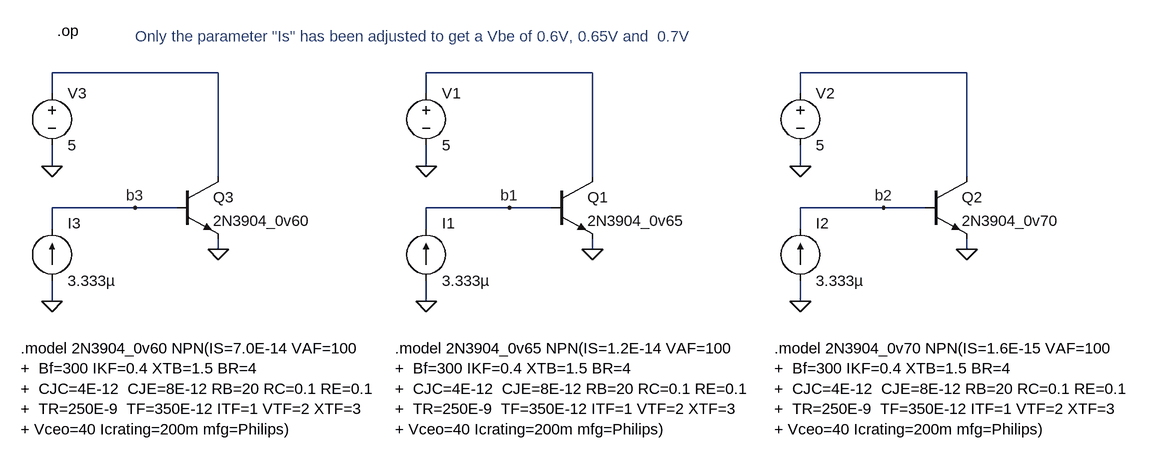
[diagram p0: schematic vbe_adjust.asc]
vbe_adjust.asc, the LTspice schematic file:
Version 4
SHEET 1 1172 680
WIRE -336 -64 -592 -64
WIRE 240 -64 -16 -64
WIRE 816 -64 560 -64
WIRE -592 -32 -592 -64
WIRE -16 -32 -16 -64
WIRE 560 -32 560 -64
WIRE -592 80 -592 48
WIRE -16 80 -16 48
WIRE 560 80 560 48
WIRE -336 96 -336 -64
WIRE 240 96 240 -64
WIRE 816 96 816 -64
WIRE -464 144 -592 144
WIRE -400 144 -464 144
WIRE 112 144 -16 144
WIRE 176 144 112 144
WIRE 688 144 560 144
WIRE 752 144 688 144
WIRE -592 176 -592 144
WIRE -16 176 -16 144
WIRE 560 176 560 144
WIRE -336 208 -336 192
WIRE 240 208 240 192
WIRE 816 208 816 192
WIRE -592 288 -592 256
WIRE -16 288 -16 256
WIRE 560 288 560 256
FLAG 240 208 0
FLAG -16 288 0
FLAG -16 80 0
FLAG 112 144 b1
FLAG 816 208 0
FLAG 560 288 0
FLAG 560 80 0
FLAG 688 144 b2
FLAG -336 208 0
FLAG -592 288 0
FLAG -592 80 0
FLAG -464 144 b3
SYMBOL npn 176 96 R0
SYMATTR InstName Q1
SYMATTR Value 2N3904_0v65
SYMBOL current -16 256 M180
WINDOW 0 24 88 Left 0
WINDOW 3 24 0 Left 0
SYMATTR InstName I1
SYMATTR Value 3.333µ
SYMBOL voltage -16 -48 R0
SYMATTR InstName V1
SYMATTR Value 5
SYMBOL npn 752 96 R0
SYMATTR InstName Q2
SYMATTR Value 2N3904_0v70
SYMBOL current 560 256 M180
WINDOW 0 24 88 Left 0
WINDOW 3 24 0 Left 0
SYMATTR InstName I2
SYMATTR Value 3.333µ
SYMBOL voltage 560 -48 R0
SYMATTR InstName V2
SYMATTR Value 5
SYMBOL npn -400 96 R0
SYMATTR InstName Q3
SYMATTR Value 2N3904_0v60
SYMBOL current -592 256 M180
WINDOW 0 24 88 Left 0
WINDOW 3 24 0 Left 0
SYMATTR InstName I3
SYMATTR Value 3.333µ
SYMBOL voltage -592 -48 R0
SYMATTR InstName V3
SYMATTR Value 5
TEXT 520 360 Left 0 !.model 2N3904_0v70 NPN(IS=1.6E-15 VAF=100\n+  Bf=300 IKF=0.4 XTB=1.5 BR=4\n+  CJC=4E-12  CJE=8E-12 RB=20 RC=0.1 RE=0.1\n+  TR=250E-9  TF=350E-12 ITF=1 VTF=2 XTF=3 \n+ Vceo=40 Icrating=200m mfg=Philips)
TEXT -584 -128 Left 0 !.op
TEXT -64 360 Left 0 !.model 2N3904_0v65 NPN(IS=1.2E-14 VAF=100\n+  Bf=300 IKF=0.4 XTB=1.5 BR=4\n+  CJC=4E-12  CJE=8E-12 RB=20 RC=0.1 RE=0.1\n+  TR=250E-9  TF=350E-12 ITF=1 VTF=2 XTF=3 \n+ Vceo=40 Icrating=200m mfg=Philips)
TEXT -640 360 Left 0 !.model 2N3904_0v60 NPN(IS=7.0E-14 VAF=100\n+  Bf=300 IKF=0.4 XTB=1.5 BR=4\n+  CJC=4E-12  CJE=8E-12 RB=20 RC=0.1 RE=0.1\n+  TR=250E-9  TF=350E-12 ITF=1 VTF=2 XTF=3 \n+ Vceo=40 Icrating=200m mfg=Philips)
TEXT -464 -120 Left 0 ;Only the parameter "Is" has been adjusted to get a Vbe of 0.6V, 0.65V and  0.7V

The netlist it stands for:
* vbe_adjust.asc
Q1 N002 b1 0 0 2N3904_0v65
I1 0 b1 3.333µ
V1 N002 0 5
Q2 N003 b2 0 0 2N3904_0v70
I2 0 b2 3.333µ
V2 N003 0 5
Q3 N001 b3 0 0 2N3904_0v60
I3 0 b3 3.333µ
V3 N001 0 5
.model NPN NPN
.model PNP PNP
.lib standard.bjt
.model 2N3904_0v70 NPN(IS=1.6E-15 VAF=100
+  Bf=300 IKF=0.4 XTB=1.5 BR=4
+  CJC=4E-12  CJE=8E-12 RB=20 RC=0.1 RE=0.1
+  TR=250E-9  TF=350E-12 ITF=1 VTF=2 XTF=3
+ Vceo=40 Icrating=200m mfg=Philips)
.op
.model 2N3904_0v65 NPN(IS=1.2E-14 VAF=100
+  Bf=300 IKF=0.4 XTB=1.5 BR=4
+  CJC=4E-12  CJE=8E-12 RB=20 RC=0.1 RE=0.1
+  TR=250E-9  TF=350E-12 ITF=1 VTF=2 XTF=3
+ Vceo=40 Icrating=200m mfg=Philips)
.model 2N3904_0v60 NPN(IS=7.0E-14 VAF=100
+  Bf=300 IKF=0.4 XTB=1.5 BR=4
+  CJC=4E-12  CJE=8E-12 RB=20 RC=0.1 RE=0.1
+  TR=250E-9  TF=350E-12 ITF=1 VTF=2 XTF=3
+ Vceo=40 Icrating=200m mfg=Philips)
* Only the parameter "Is" has been adjusted to get a Vbe of 0.6V, 0.65V and  0.7V
.backanno
.end